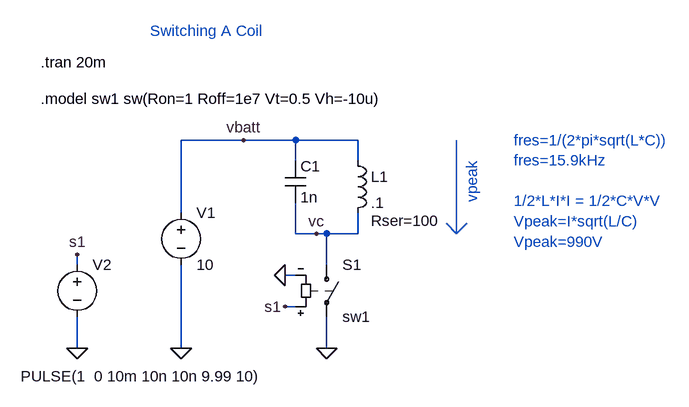
[diagram p0: schematic SwitchCoil.asc]
SwitchCoil.asc, the LTspice schematic file:
Version 4
SHEET 1 880 680
WIRE 16 80 -80 80
WIRE 96 80 16 80
WIRE 192 80 96 80
WIRE 96 112 96 80
WIRE 192 112 192 80
WIRE -80 192 -80 80
WIRE 96 224 96 176
WIRE 128 224 96 224
WIRE 144 224 128 224
WIRE 192 224 192 192
WIRE 192 224 144 224
WIRE -240 272 -240 256
WIRE 144 272 144 224
WIRE 96 288 80 288
WIRE 96 336 80 336
WIRE -240 400 -240 352
WIRE -80 400 -80 272
WIRE 144 400 144 352
FLAG 144 400 0
FLAG -80 400 0
FLAG -240 400 0
FLAG -240 256 s1
FLAG 80 288 0
FLAG 80 336 s1
FLAG 128 224 vc
FLAG 16 80 vbatt
SYMBOL ind 176 96 R0
WINDOW 39 36 108 Left 0
SYMATTR InstName L1
SYMATTR Value .1
SYMATTR SpiceLine Rser=100
SYMBOL cap 80 112 R0
SYMATTR InstName C1
SYMATTR Value 1n
SYMBOL sw 144 256 R0
SYMATTR InstName S1
SYMATTR Value sw1
SYMBOL voltage -80 176 R0
WINDOW 123 0 0 Left 0
WINDOW 39 0 0 Left 0
SYMATTR InstName V1
SYMATTR Value 10
SYMBOL voltage -240 256 R0
WINDOW 3 -87 187 Left 0
WINDOW 123 0 0 Left 0
WINDOW 39 0 0 Left 0
SYMATTR Value PULSE(1  0 10m 10n 10n 9.99 10)
SYMATTR InstName V2
TEXT -296 16 Left 0 !.model sw1 sw(Ron=1 Roff=1e7 Vt=0.5 Vh=-10u)
TEXT -296 -40 Left 0 !.tran 20m
TEXT 432 80 Left 0 ;fres=1/(2*pi*sqrt(L*C))\nfres=15.9kHz\n \n1/2*L*I*I = 1/2*C*V*V\nVpeak=I*sqrt(L/C)\nVpeak=990V
TEXT 368 176 VLeft 0 ;vpeak
TEXT -128 -88 Left 0 ;Switching A Coil
LINE Normal 344 224 344 80
LINE Normal 360 208 344 224
LINE Normal 344 224 360 208
LINE Normal 328 208 344 224

The netlist it stands for:
* SwitchCoil.asc
L1 vbatt vc .1 Rser=100
C1 vbatt vc 1n
S1 vc 0 s1 0 sw1
V1 vbatt 0 10
V2 s1 0 PULSE(1  0 10m 10n 10n 9.99 10)
.model sw1 sw(Ron=1 Roff=1e7 Vt=0.5 Vh=-10u)
.tran 20m
* fres=1/(2*pi*sqrt(L*C))
* fres=15.9kHz
* 1/2*L*I*I = 1/2*C*V*V
* Vpeak=I*sqrt(L/C)
* Vpeak=990V
* vpeak
* Switching A Coil
.backanno
.end